# Altium schematic sheet pyra_dvt1_power-2.0.SchDoc
size C; SheetNumber: 1; SheetTotal: 1
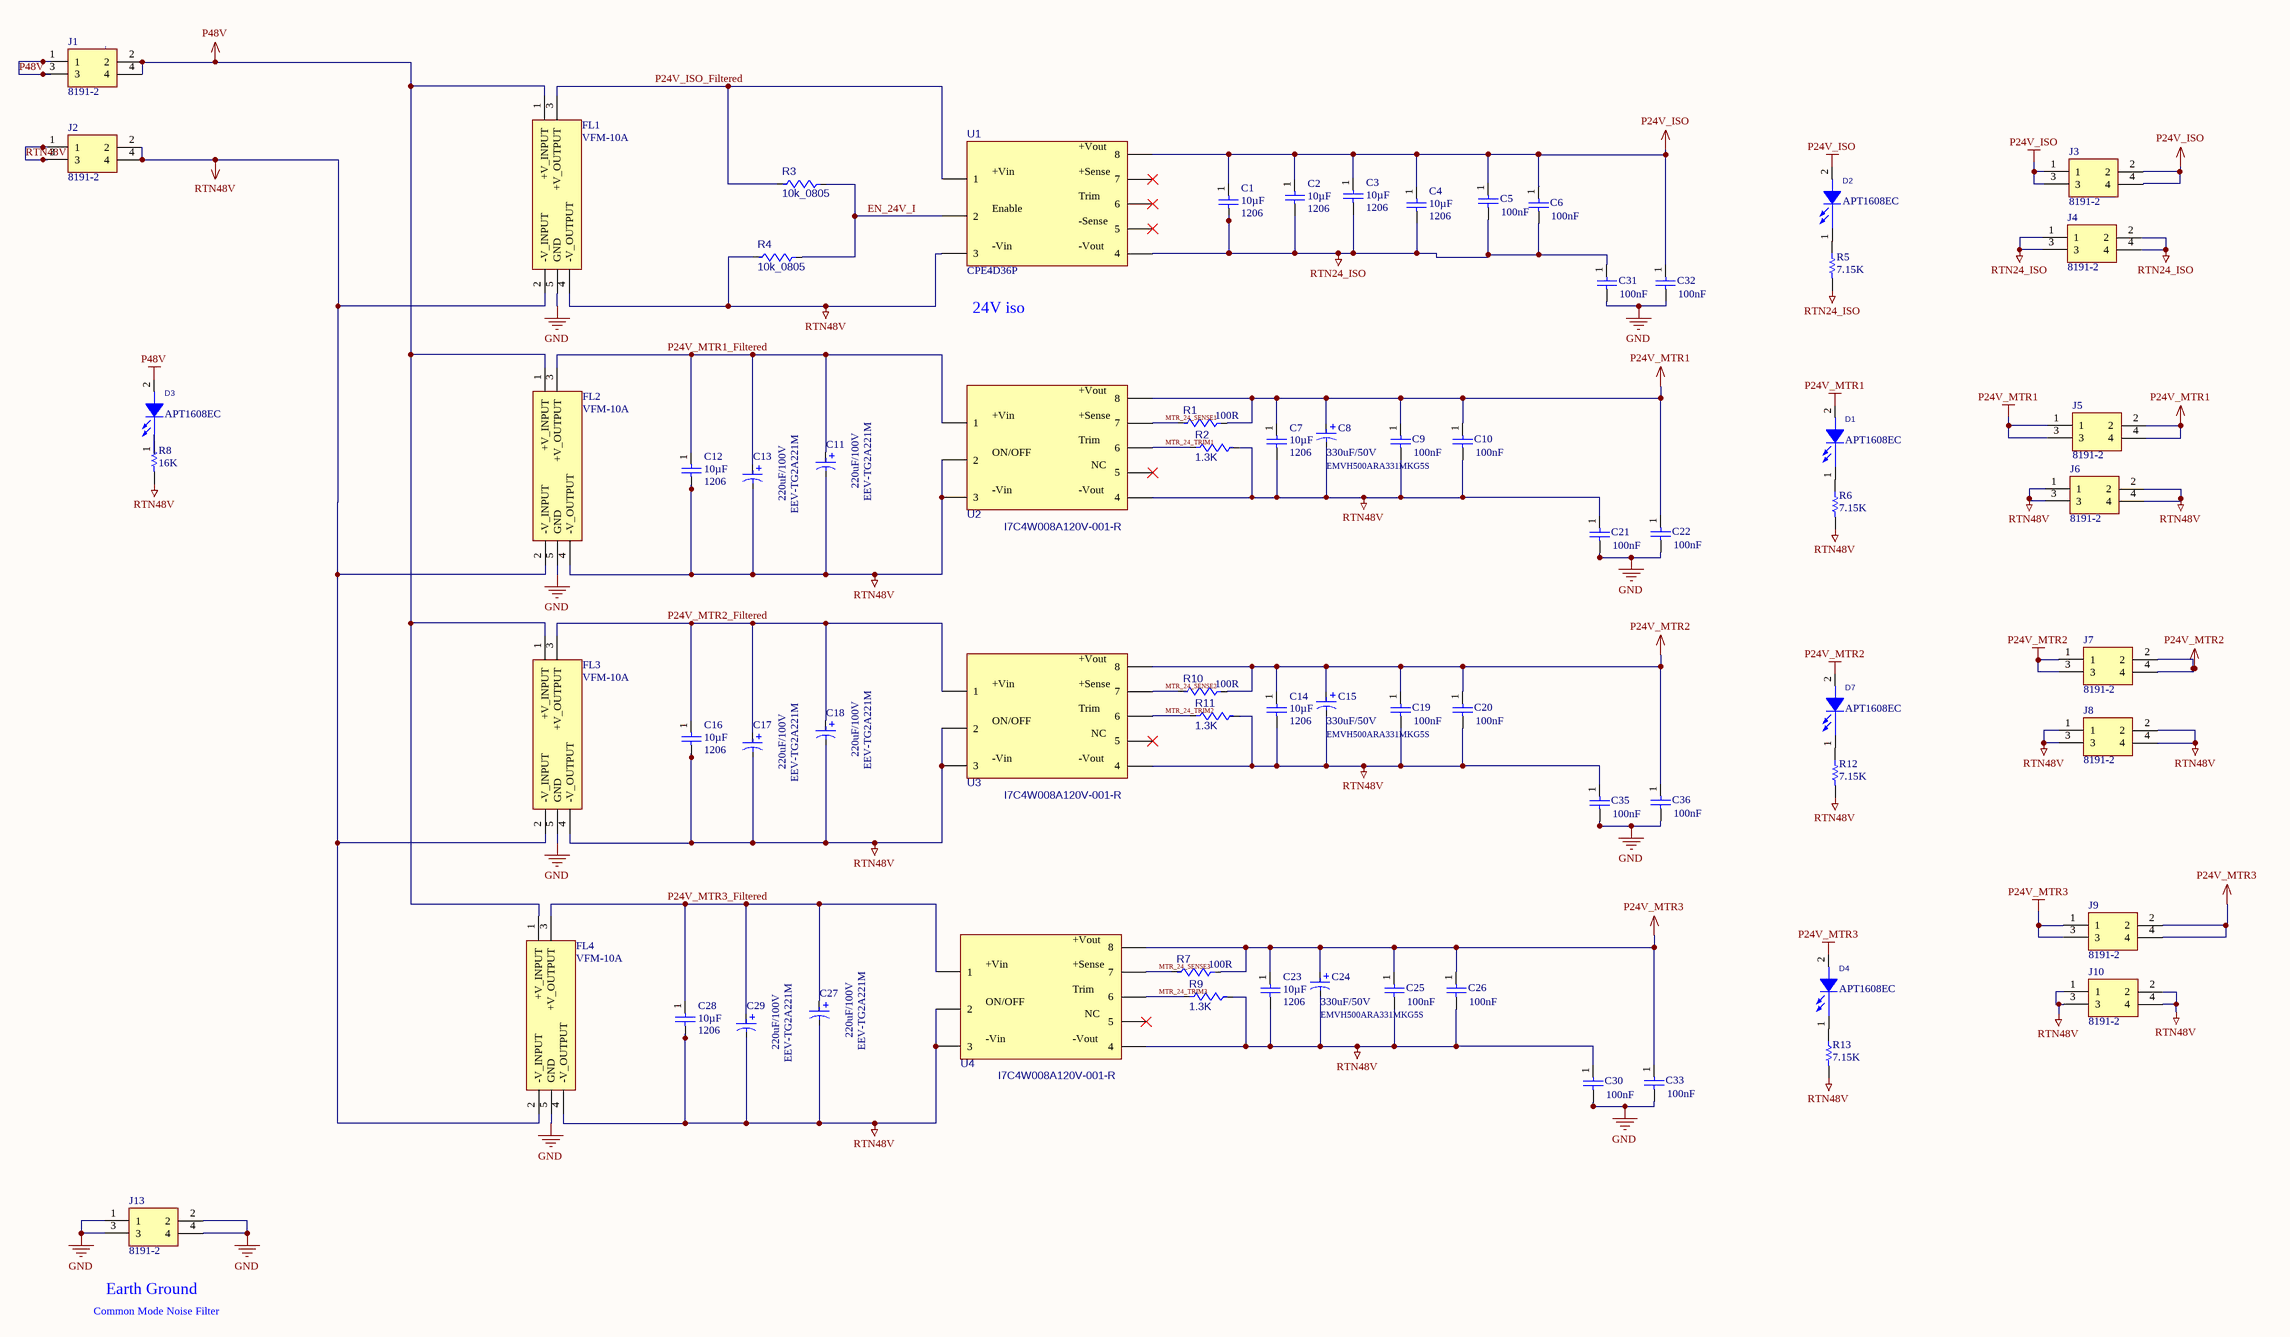
[diagram p0: pyra_dvt1_power-2.0.SchDoc]

## Parts
C1  value 10µF  [1206]  (hidden comment: C1206_10UF_50V)
C2  value 10µF  [1206]  (hidden comment: C1206_10UF_50V)
C3  value 10µF  [1206]  (hidden comment: C1206_10UF_50V)
C4  value 10µF  [1206]  (hidden comment: C1206_10UF_50V)
C5  value 100nF  [0603R(1608)]  (hidden comment: C0603_100NF_50V)
C6  value 100nF  [0603R(1608)]  (hidden comment: C0603_100NF_50V)
C7  value 10µF  [1206]  (hidden comment: C1206_10UF_50V)
C8  330uF/50V  [EMVH500ARA331MKG5S]
C9  value 100nF  [0603R(1608)]  (hidden comment: C0603_100NF_50V)
C10  value 100nF  [0603R(1608)]  (hidden comment: C0603_100NF_50V)
C11  220uF/100V  Manufacturer Part Number: EEV-TG2A221M  [EMVH101GDA221MMN0S]
C12  value 10µF  [1206]  (hidden comment: C1206_10UF_50V)
C13  220uF/100V  Manufacturer Part Number: EEV-TG2A221M  [EMVH101GDA221MMN0S]
C14  value 10µF  [1206]  (hidden comment: C1206_10UF_50V)
C15  330uF/50V  [EMVH500ARA331MKG5S]
C16  value 10µF  [1206]  (hidden comment: C1206_10UF_50V)
C17  220uF/100V  Manufacturer Part Number: EEV-TG2A221M  [EMVH101GDA221MMN0S]
C18  220uF/100V  Manufacturer Part Number: EEV-TG2A221M  [EMVH101GDA221MMN0S]
C19  value 100nF  [0603R(1608)]  (hidden comment: C0603_100NF_50V)
C20  value 100nF  [0603R(1608)]  (hidden comment: C0603_100NF_50V)
C21  value 100nF  [0603R(1608)]  (hidden comment: C0603_100NF_50V)
C22  value 100nF  [0603R(1608)]  (hidden comment: C0603_100NF_50V)
C23  value 10µF  [1206]  (hidden comment: C1206_10UF_50V)
C24  330uF/50V  [EMVH500ARA331MKG5S]
C25  value 100nF  [0603R(1608)]  (hidden comment: C0603_100NF_50V)
C26  value 100nF  [0603R(1608)]  (hidden comment: C0603_100NF_50V)
C27  220uF/100V  Manufacturer Part Number: EEV-TG2A221M  [EMVH101GDA221MMN0S]
C28  value 10µF  [1206]  (hidden comment: C1206_10UF_50V)
C29  220uF/100V  Manufacturer Part Number: EEV-TG2A221M  [EMVH101GDA221MMN0S]
C30  value 100nF  [0603R(1608)]  (hidden comment: C0603_100NF_50V)
C31  value 100nF  [0603R(1608)]  (hidden comment: C0603_100NF_50V)
C32  value 100nF  [0603R(1608)]  (hidden comment: C0603_100NF_50V)
C33  value 100nF  [0603R(1608)]  (hidden comment: C0603_100NF_50V)
C35  value 100nF  [0603R(1608)]  (hidden comment: C0603_100NF_50V)
C36  value 100nF  [0603R(1608)]  (hidden comment: C0603_100NF_50V)
D1  APT1608EC  [APT1608EC]
D2  APT1608EC  [APT1608EC]
D3  APT1608EC  [APT1608EC]
D4  APT1608EC  [APT1608EC]
D7  APT1608EC  [APT1608EC]
FL1  VFM-10A  [VFM10A]
FL2  VFM-10A  [VFM10A]
FL3  VFM-10A  [VFM10A]
FL4  VFM-10A  [VFM10A]
J1  8191-2  [81912]
J2  8191-2  [81912]
J3  8191-2  [81912]
J4  8191-2  [81912]
J5  8191-2  [81912]
J6  8191-2  [81912]
J7  8191-2  [81912]
J8  8191-2  [81912]
J9  8191-2  [81912]
J10  8191-2  [81912]
J13  8191-2  [81912]
R1  Resistance: 100R  [0805]  (hidden comment: ?)
R2  1.3K  [0603R(1608)]
R3  10k_0805  [0805]
R4  10k_0805  [0805]
R5  Resistance (Ohms): 7.15K  [0603R(1608)]  (hidden comment: 10k)
R6  Resistance (Ohms): 7.15K  [0603R(1608)]  (hidden comment: 10k)
R7  Resistance: 100R  [0805]  (hidden comment: ?)
R8  Resistance (Ohms): 16K  [0603R(1608)]  (hidden comment: 10k)
R9  1.3K  [0603R(1608)]
R10  Resistance: 100R  [0805]  (hidden comment: ?)
R11  1.3K  [0603R(1608)]
R12  Resistance (Ohms): 7.15K  [0603R(1608)]  (hidden comment: 10k)
R13  Resistance (Ohms): 7.15K  [0603R(1608)]  (hidden comment: 10k)
U1  CPE4D36P  [CPE4D36N]
U2  I7C4W008A120V-001-R  [CPT2D36P]
U3  I7C4W008A120V-001-R  [CPT2D36P]
U4  I7C4W008A120V-001-R  [CPT2D36P]

## Nets
GND: C21.2 C22.2 C30.2 C31.2 C32.2 C33.2 C35.2 C36.2 FL1.5(GND) FL2.5(GND) FL3.5(GND) FL4.5(GND) J13.1 J13.2 J13.3 J13.4
P24V_ISO: C1.1 C2.1 C3.1 C4.1 C5.1 C6.1 C32.1 D2.2(ANODE) J3.1 J3.2 J3.3 J3.4 U1.8
P24V_MTR1: C7.1 C8.1 C9.1 C10.1 C22.1 D1.2(ANODE) J5.1 J5.2 J5.3 J5.4 R1.2 U2.8
P24V_MTR2: C14.1 C15.1 C19.1 C20.1 C36.1 D7.2(ANODE) J7.1 J7.2 J7.3 J7.4 R10.2 U3.8
P24V_MTR3: C23.1 C24.1 C25.1 C26.1 C33.1 D4.2(ANODE) J9.1 J9.2 J9.3 J9.4 R7.2 U4.8
P48V: D3.2(ANODE) FL1.1(+V_INPUT) FL2.1(+V_INPUT) FL3.1(+V_INPUT) FL4.1(+V_INPUT) J1.1 J1.2 J1.3 J1.4
RTN24_ISO: C1.2 C2.2 C3.2 C4.2 C5.2 C6.2 C31.1 J4.1 J4.2 J4.3 J4.4 R5.2 U1.4
RTN48V: C7.2 C8.2 C9.2 C10.2 C11.2 C12.2 C13.2 C14.2 C15.2 C16.2 C17.2 C18.2 C19.2 C20.2 C21.1 C23.2 C24.2 C25.2 C26.2 C27.2 C28.2 C29.2 C30.1 C35.1 FL1.2(-V_INPUT) FL1.4(-V_OUTPUT) FL2.2(-V_INPUT) FL2.4(-V_OUTPUT) FL3.2(-V_INPUT) FL3.4(-V_OUTPUT) FL4.2(-V_INPUT) FL4.4(-V_OUTPUT) J2.1 J2.2 J2.3 J2.4 J6.1 J6.2 J6.3 J6.4 J8.1 J8.2 J8.3 J8.4 J10.1 J10.2 J10.3 J10.4 R2.1 R4.1 R6.2 R8.2 R9.1 R11.1 R12.2 R13.2 U1.3 U2.2 U2.3 U2.4 U3.2 U3.3 U3.4 U4.2 U4.3 U4.4
EN_24V_I: R3.2 R4.2 U1.2
MTR_24_SENSE1: R1.1 U2.7
MTR_24_SENSE2: R10.1 U3.7
MTR_24_SENSE3: R7.1 U4.7
MTR_24_TRIM1: R2.2 U2.6
MTR_24_TRIM2: R11.2 U3.6
MTR_24_TRIM3: R9.2 U4.6
P24V_ISO_Filtered: FL1.3(+V_OUTPUT) R3.1 U1.1
P24V_MTR1_Filtered: C11.1 C12.1 C13.1 FL2.3(+V_OUTPUT) U2.1
P24V_MTR2_Filtered: C16.1 C17.1 C18.1 FL3.3(+V_OUTPUT) U3.1
P24V_MTR3_Filtered: C27.1 C28.1 C29.1 FL4.3(+V_OUTPUT) U4.1
NetD1_1: D1.1(CATHODE) R6.1
NetD2_1: D2.1(CATHODE) R5.1
NetD3_1: D3.1(CATHODE) R8.1
NetD4_1: D4.1(CATHODE) R13.1
NetD7_1: D7.1(CATHODE) R12.1

Not connected (* = marked no-connect by the designer): U1 5* 6* 7*; U2 5*; U3 5*; U4 5*

## Notes on the sheet
- (near J1) +
- (near U1) 24V iso
- Common Mode Noise Filter
- (near J13) Earth Ground
- (in symbol CPE4D36N) +Vout; +Vin; +Sense; Trim; Enable; -Sense; -Vin; -Vout
- (in symbol I7C4W008A120V-001-R) +Vout; +Vin; +Sense; Trim; ON/OFF; NC; -Vin; -Vout

## Library data of the parts
C1-C4 C7 C12 C14 C16 C23 C28 = C1206_10UF_50V: CAP CER 10UF 50V X5R 1206; Manufacturer: TDK Corporation; Manufacturer Part Number: C3216X5R1H106M160AB; Manufacturer Two: Any equivalent to description; Manufacturer Two Part Number: Per manufacturer; Tolerance: ±20%; Supplier 1: Digi-Key; Supplier Part Number 1: 445-5999-1-ND; RoHS: RoHS Compliant; Category: Capacitors; Stock 1: 17969; Pricing 1: 1=0.93, 10=0.706, 100=0.5053, 1000=0.33689 (USD); Packaging: Cut Tape (CT); Part Status: Active; Capacitance: 10µF; Temperature Coefficient: X5R; Operating Temperature: -55°C ~ 85°C; Features: Low ESL; Ratings: -; Applications: General Purpose; Failure Rate: -; Mounting Type: Surface Mount, MLCC; Package / Case: 1206 (3216 Metric); Size / Dimension: 0.126" L x 0.063" W (3.20mm x 1.60mm); Height - Seated (Max): -; Thickness (Max): 0.071" (1.80mm); Lead Spacing: -; Lead Style: -; ComponentLink1URL: https://product.tdk.com/info/en/catalog/datasheets/mlcc_commercial_general_en.pdf; ComponentLink1Description: https://product.tdk.com/info/en/catalog/datasheets/mlcc_commercial_general_en.pdf; Voltage - Rated: 50V; Size: 1206
C5 C6 C9 C10 C19-C22 C25 C26 C30-C33 C35 C36 = C0603_100NF_50V: CAP CER 0.1UF 50V X5R 0603; Manufacturer: TDK Corporation; Manufacturer Part Number: CGA3E2X5R1H104K080AA; Manufacturer Two: Any equivalent to description; Manufacturer Two Part Number: Per manufacturer; Capacitance: 0.1µF; Tolerance: ±10%; Supplier 1: Digi-Key; Supplier Part Number 1: 445-12498-1-ND; RoHS: RoHS Compliant; Category: Capacitors; Stock 1: 8997; Pricing 1: 1=0.1, 10=0.076, 25=0.0552, 50=0.0414, 100=0.0338, 250=0.02828, 500=0.02416, 1000=0.01898 (USD); Packaging: Cut Tape (CT); Part Status: Active; Voltage - Rated: 50V; Temperature Coefficient: X5R; Operating Temperature: -55°C ~ 85°C; Features: -; Ratings: AEC-Q200; Applications: Automotive; Failure Rate: -; Mounting Type: Surface Mount, MLCC; Package / Case: 0603 (1608 Metric); Size / Dimension: 0.063" L x 0.031" W (1.60mm x 0.80mm); Height - Seated (Max): -; Thickness (Max): 0.035" (0.90mm); Lead Spacing: -; Lead Style: -; ComponentLink1URL: https://product.tdk.com/info/en/catalog/datasheets/mlcc_automotive_general_en.pdf; ComponentLink1Description: https://product.tdk.com/info/en/catalog/datasheets/mlcc_automotive_general_en.pdf
C8 C15 C24 = CAP POLAR  330uF: CAP ALUM 330UF 20% 50V SMD; Manufacturer: United Chemi-con; _Verified Footprint: .mfr-pn? footprint?; _Verified Symbol: .mfr-pn?; Life (Hours): 5000Hour; Ripple Current: 350mA; Leakage Current: 4uA; _Verified BOM: .mfr-pn?; Supplier 1: Digi-Key; Supplier Part Number 1: 565-2329-2-ND; Manufacturer Part Number: EMVH500ARA331MKG5S; RoHS: Yes; Category: Aluminum Electrolytic Capacitors; Stock 1: 1200; Case/Package: Radial; Number of Pins: 2; Min Operating Temperature: -40°C; Max Operating Temperature: 125°C; Package Quantity: 200; Tolerance: 20%; Voltage Rating (DC): 50V; Packaging: Tape and Reel; Capacitance: 330uF; Voltage Rating: 50V; Termination: SMD/SMT; Diameter: 12.5mm; Length: 13mm; Height: 13mm; Radiation Hardening: No; Lead Free: Lead Free; ComponentLink1Description: https://www.chemi-con.com/upload/files/9/3/45226975052d6c71e04ba0.pdf; ComponentLink1URL: https://www.chemi-con.com/upload/files/9/3/45226975052d6c71e04ba0.pdf
C11 C13 C17 C18 C27 C29 = CAP POLAR  220uF: CAP ALUM 220UF 20% 100V SMD; Manufacturer: Panasonic; _Verified Footprint: .mfr-pn? footprint?; _Verified Symbol: .mfr-pn?; Life (Hours): 5000Hour; Ripple Current: 400mA; Leakage Current: 4uA; _Verified BOM: .mfr-pn?; Supplier 1: Digi-Key; Supplier Part Number 1: PCE3698TR-ND; RoHS: Yes; Category: Aluminum Electrolytic Capacitors; Stock 1: 875; Case/Package: Radial; Number of Pins: 2; Min Operating Temperature: -40°C; Max Operating Temperature: 125°C; Package Quantity: 125; Tolerance: 20%; Voltage Rating (DC): 100V; Packaging: Tape and Reel; Capacitance: 220uF; Voltage Rating: 100V; Termination: SMD/SMT; Diameter: 18mm; Length: 16.5mm; Height: 16.5mm; Radiation Hardening: No; Lead Free: Lead Free
  C11 C18 C27: ComponentLink1Description: https://industrial.panasonic.com/cdbs/www-data/pdf/RDE0000/ABA0000C1187.pdf; ComponentLink1URL: https://industrial.panasonic.com/cdbs/www-data/pdf/RDE0000/ABA0000C1187.pdf*
  C13 C17 C29: ComponentLink1Description: https://www.chemi-con.com/upload/files/9/3/45226975052d6c71e04ba0.pdf; ComponentLink1URL: https://www.chemi-con.com/upload/files/9/3/45226975052d6c71e04ba0.pdf
D1-D4 D7 = LED_red_0603: red, 0603; Manufacturer: Kingbright; Lens Color: Clear; Forward Current: 20mA; Forward Voltage: 2V; Luminous Intensity: 12mcd; Viewing Angle: 120°; Lens Style: Clear,Flat; Dominant Wavelength: 625nm; Number of LEDs: 1; Manufacturer Part Number: APT1608EC; Supplier 1: Digi-Key; Supplier Part Number 1: 754-1117-6-ND; Stock 1: 93649; Pricing 1: 1=0.35, 10=0.259, 25=0.1912, 100=0.1365, 250=0.09284, 500=0.0819, 1000=0.06416 (USD); Mount: Surface Mount; Case/Package: 0603; Number of Pins: 2; Color: Red; Case Code (Metric): 1608; Case Code (Imperial): 0603; Min Operating Temperature: -40°C; Max Operating Temperature: 85°C; Illumination Color: Red; Packaging: Tape and Reel; Package Quantity: 2000; Test Current: 20mA; Wavelength: 625nm; Length: 1.6mm; Height: 0.75mm; Width: 0.8mm; Lead Free: Lead Free; ComponentLink1URL: http://www.kingbrightusa.com/images/catalog/SPEC/APT1608EC.pdf?src-supplier=Digi-Key; ComponentLink1Description: http://www.kingbrightusa.com/images/catalog/SPEC/APT1608EC.pdf?src-supplier=Digi-Key; ComponentLink2URL: https://www.alliedelec.com/m/d/8f77ba6adbc677900716b25e6ddbc771.pdf?src-supplier=Allied+Electronics; ComponentLink2Description: https://www.alliedelec.com/m/d/8f77ba6adbc677900716b25e6ddbc771.pdf?src-supplier=Allied+Electronics; ComponentLink3URL: http://www.kingbrightusa.com/images/catalog/SPEC/APT1608EC.pdf?src-supplier=Future+Electronics; ComponentLink3Description: http://www.kingbrightusa.com/images/catalog/SPEC/APT1608EC.pdf?src-supplier=Future+Electronics
FL1-FL4 = CMP-002-000003-1: Power Line Filters 0-75Vin 10A DC EMI Filter; Manufacturer_Name: CUI Inc.; Source: SamacSys.SchLib; Height: 11.7mm; Arrow Price/Stock: https://www.arrow.com/en/products/vfm-10a/cui-inc; Arrow Part Number: VFM-10A; Mouser Part Number: 490-VFM-10A; Design Item ID: VFM-10A; Manufacturer_Part_Number: VFM-10A; Datasheet Link: https://www.cui.com/product/resource/vfm-xx.pdf; Mouser Price/Stock: https://www.mouser.co.uk/ProductDetail/CUI-Inc/VFM-10A?qs=WyjlAZoYn52c0yYVx%252BhHOQ%3D%3D
J1-J10 J13 = CMP-002-000000-1: Keystone, Brass Screw Terminal, 22  14 AWG, 15A; Manufacturer_Name: Keystone Electronics; Geometry.Height: 11.176mm; Manufacturer_Part_Number: 8191-2; Source: 8191-2.SchLib; Mouser Price/Stock: https://www.mouser.co.uk/ProductDetail/Keystone-Electronics/8191-2?qs=zBlGwAMnvtcLi4%252BTp6EI2A%3D%3D; Datasheet Link: *; Design Item ID: 8191-2; Mouser Part Number: 534-8191-2
R1 R7 R10 = RES .val? 0805: RES 100 OHM 5% 1/4W 0805; Manufacturer: KOA; Manufacturer Part Number: RK73B2ATTD101J; _Verified Footprint: .mfr-pn? footprint?; _Verified BOM: .mfr-pn?; Max Power Dissipation: 250mW; Temperature Coefficient: 200ppm/°C; _Verified Symbol: .mfr-pn?; Supplier 1: Digi-Key; Supplier Part Number 1: 2019-RK73B2ATTD101JTR-ND; RoHS: Yes; Category: Chip SMD Resistors; Stock 1: 4773; Pricing 1: 1=0.14000, 10=0.12400, 100=0.04790, 1000=0.02105, 2500=0.01818 (USD); Case/Package: 0805; Case Code (Metric): 2012; Case Code (Imperial): 0805; Min Operating Temperature: -55°C; Max Operating Temperature: 155°C; Package Quantity: 1; Tolerance: 5%; Packaging: Tape and Reel; Resistor Type: Thick Film; Number of Terminations: 2; Features: Automotive AEC-Q200; Length: 0.079inch; Height: 0.024inch; Width: 0.049inch; ComponentLink1Description: https://www.koaspeer.com/pdfs/RK73B.pdf; ComponentLink1URL: https://www.koaspeer.com/pdfs/RK73B.pdf
R2 R9 R11 = RES .val? .pkg?: RES SMD 1.3K OHM 1% 1/10W 0603; Manufacturer: Panasonic; Manufacturer Part Number: ERJ-3EKF1301V; _Verified Footprint: .mfr-pn? footprint?; _Verified Symbol: .mfr-pn?; Power Rating: 100mW; Temperature Coefficient: 100ppm/°C; _Verified BOM: .mfr-pn?; Supplier 1: Digi-Key; Supplier Part Number 1: P1.30KHTR-ND; RoHS: Yes; Category: Chip SMD Resistors; Mount: Surface Mount; Case/Package: 0603; Case Code (Metric): 1608; Case Code (Imperial): 0603; Min Operating Temperature: -55°C; Max Operating Temperature: 155°C; Resistance: 1.3K; Tolerance: 1%; Packaging: Tape and Reel; Composition: Thick Film; Number of Terminations: 2; Termination: Solder; Max Power Dissipation: 100mW; Length: 0.061inch; Height: 0.022inch; Width: 0.031inch; Depth: 0.8mm; REACH SVHC: No SVHC; ComponentLink1Description: https://industrial.panasonic.com/cdbs/www-data/pdf/RDA0000/AOA0000C304.pdf; ComponentLink1URL: https://industrial.panasonic.com/cdbs/www-data/pdf/RDA0000/AOA0000C304.pdf
R3 R4 = RES 10k_0805: Res Thick Film 0805 10K Ohm 1% 0.125W ±100ppm/°C Molded SMD Paper T/R; Manufacturer: Stackpole Electronics; Manufacturer Part Number: RMCF0805FT10K0; Resistance: 10kR; Power Rating: 125mW; ComponentLink1URL: https://datasheet.ciiva.com/11821/0900766b80f80784-11821667.pdf?src-supplier=RSComponents; ComponentLink1Description: https://datasheet.ciiva.com/11821/0900766b80f80784-11821667.pdf?src-supplier=RSComponents; ComponentLink2URL: https://datasheet.ciiva.com/46381/1678782-46381561.pdf?src-supplier=Element14; ComponentLink2Description: https://datasheet.ciiva.com/46381/1678782-46381561.pdf?src-supplier=Element14; ComponentLink3URL: https://datasheet.ciiva.com/22682/1678782-22682207.pdf?src-supplier=Element14; ComponentLink3Description: https://datasheet.ciiva.com/22682/1678782-22682207.pdf?src-supplier=Element14; ComponentLink4URL: https://datasheet.ciiva.com/46381/1678782-46381560.pdf?src-supplier=Element14; ComponentLink4Description: https://datasheet.ciiva.com/46381/1678782-46381560.pdf?src-supplier=Element14; ComponentLink5URL: https://datasheet.ciiva.com/24026/aoa0000ce2-24026488.pdf?src-supplier=Mouser; ComponentLink5Description: https://datasheet.ciiva.com/24026/aoa0000ce2-24026488.pdf?src-supplier=Mouser; ComponentLink6URL: https://datasheet.ciiva.com/16788/70260748-16788109.pdf?src-supplier=Allied+Electronics; ComponentLink6Description: https://datasheet.ciiva.com/16788/70260748-16788109.pdf?src-supplier=Allied+Electronics; ComponentLink7URL: https://datasheet.ciiva.com/16774/70260748-16774949.pdf?src-supplier=Allied+Electronics; ComponentLink7Description: https://datasheet.ciiva.com/16774/70260748-16774949.pdf?src-supplier=Allied+Electronics; ComponentLink8URL: https://datasheet.ciiva.com/30051/aoa0000ce2-30051758.pdf?src-supplier=Onlinecomponents.com; ComponentLink8Description: https://datasheet.ciiva.com/30051/aoa0000ce2-30051758.pdf?src-supplier=Onlinecomponents.com; ComponentLink9URL: https://datasheet.ciiva.com/17209/aoa0000ce2-17209430.pdf?src-supplier=Avnet+Europe; ComponentLink9Description: https://datasheet.ciiva.com/17209/aoa0000ce2-17209430.pdf?src-supplier=Avnet+Europe; Supplier 1: Digi-Key; RoHS: Yes; Category: Chip SMD Resistors; Stock 1: 10552273; Pricing 1: 5000=0.00350 (USD); Mount: Surface Mount; Case/Package: 0805; Case Code (Metric): 2012; Case Code (Imperial): 0805; Contact Plating: Tin,Matte; Size Code: 0805; Min Operating Temperature: -55°C; Max Operating Temperature: 155°C; Tolerance: 1%; Packaging: Tape and Reel; Resistor Type: Thick Film; Number of Terminations: 2; Temperature Coefficient: 100ppm/°C; Max Power Dissipation: 125mW; Features: Automotive AEC-Q200; Series: RMCF; Construction: Rectangular; Length: 2mm; Width: 0.049inch; Height: 0.026inch; Depth: 1.25mm; Radiation Hardening: No; Lead Free: Lead Free; Military Standard: Not; RoHS Compliant: Yes; ComponentLink10URL: https://datasheet.ciiva.com/15193/getdatasheetpartid-362046-15193525.pdf?src-supplier=Verical; ComponentLink10Description: https://datasheet.ciiva.com/15193/getdatasheetpartid-362046-15193525.pdf?src-supplier=Verical; Supplier Part Number 1: RMCF0805FT10K0TR-ND
R5 R6 R8 R12 R13 = RES-0603-10K_1: RES SMD 10K OHM 5% 1/10W 0603; Manufacturer: Panasonic Electronic Components; Manufacturer Part Number: RMCF0603FT7K15; Manufacturer Two: Any equivalent to description; Manufacturer Two Part Number: Per manufacturer; Tolerance: ±1%; Proto Cost @ 100: 0.0068; Temperature Coefficient: ±100ppm/°C; Power (Watts): 0.1W, 1/10W; Symbol Revision Notes: *; Pin Count: 2; RoHS: RoHS Compliant; Supplier 1: Digi-Key; Packaging: Cut Tape (CT); Series: RMC; Supplier Part Number 1: RMCF0603FT7K15TR-ND; Package / Case: 0603 (1608 Metric); Size / Dimension: 0.063" L x 0.031" W (1.60mm x 0.80mm); Validated: -; Height: 0.022" (0.55mm); Composition: Thick Film; ComponentLink1URL: http://industrial.panasonic.com/www-cgi/jvcr13pz.cgi?E+PZ+3+AOA0002+ERJ3EKF1200V+7+WW
U1 = CPE4D36N: Isolated Module DC DC Converter 1 Output 24V    4A 18V - 72V Input; Manufacturer: Semiconductor Circuits, Inc.; Manufacture2: NetPower; Manufacturer2 Part Number: ERS3240N004N25W; Notes: NetPower fit R38 remove R37; Supplier 1: Digi-Key; Manufacturer Part Number: CPE4D36P; RoHS: No; Category: Board Mount Modules; Stock 1: 37
U2-U4 = I7C4W008A120V-001-R: DC DC CONVERTER 9.6-48V OUTPUT 300W 8A 9V - 53V INPUT; Manufacturer: TDK-Lambda; Supplier 1: Digikey; Manufacturer Part Number: I7C4W008A120V-001-R; RoHS: Yes; Category: Board Mount Modules